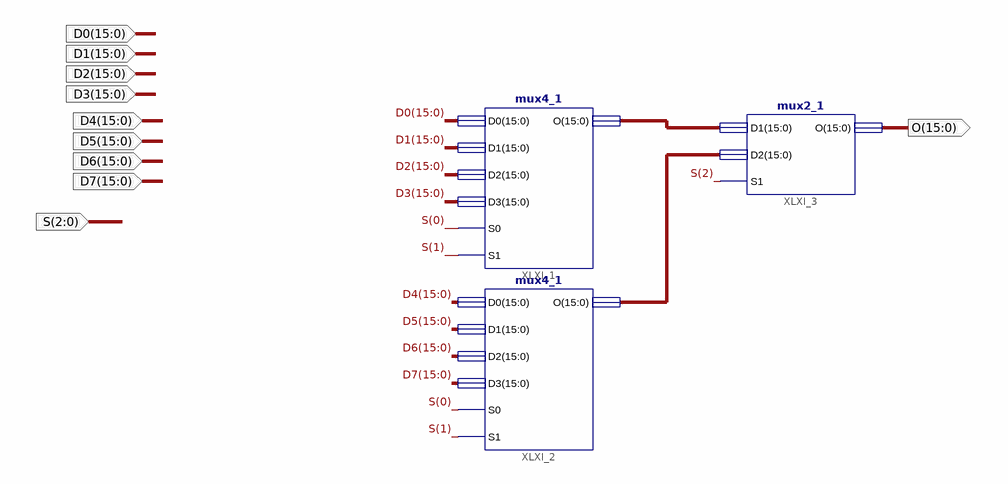
[diagram p0: schematic sheet 1]
// Xilinx ISE schematic mux8x16.sch (spartan3e) as structural Verilog: 3 symbols, 10 ports
module mux8x16 (
  input  [15:0] D3,
  input  [15:0] D2,
  input  [15:0] D1,
  input  [15:0] D0,
  input  [15:0] D4,
  input  [15:0] D5,
  input  [15:0] D6,
  input  [15:0] D7,
  input  [2:0] S,
  output [15:0] O
);

  wire [15:0] XLXN_37, XLXN_38;

  mux4_1 XLXI_1 (.D0(D0), .D1(D1), .D2(D2), .D3(D3), .S0(S[0]), .S1(S[1]), .O(XLXN_37));
  mux4_1 XLXI_2 (.D0(D4), .D1(D5), .D2(D6), .D3(D7), .S0(S[0]), .S1(S[1]), .O(XLXN_38));
  mux2_1 XLXI_3 (.D1(XLXN_37), .D2(XLXN_38), .S1(S[2]), .O(O));
endmodule
